# Altium project KEY.PrjPcb
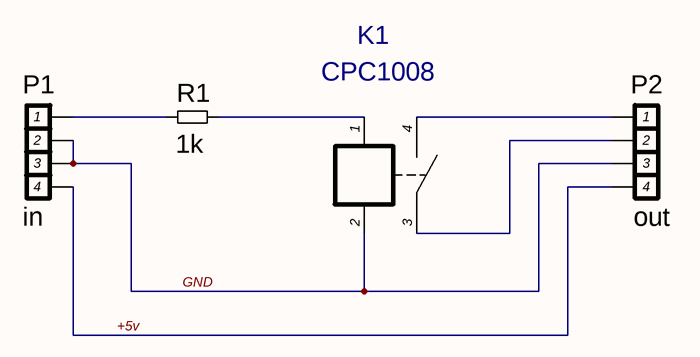
[diagram p0: KEY.SchDoc]
1 sheet, 4 parts. Net scope: global (net labels, ports and power ports of the same name join across sheets).
Board file: KEY.PcbDoc

## Sheet KEY.SchDoc
size A2; Organization: HOME; Address1: L3, 12a Rodborough Rd; Address2: Frenchs Forest; Address3: NSW; Address4: Australia 2086; PageSetup: Record=PageOptions|CenterHorizontal=True|CenterVertical=True|PrintScale=0.49|XCorrection=1.00|YCorrection=1.00|PrintKind=0|BorderSize=5000000|LeftOffset=0|BottomOffset=0|Orientation=2|PaperLength=1000|PaperWidth=1000|Scale=100|PaperSource=7|PrintQuality=-3|MediaType=1|DitherType=10|PrintScaleMode=1|PaperKind=A4|PaperIndex=9

### Parts
K1  CPC1008  [SOIC4]
P1  in  [Header 4]
P2  out  [Header 4]
R1  1k  [RES_0805]

### Nets
+5v: P1.4 P2.4
GND: K1.2 P1.2 P1.3 P2.3
NetK1_1: K1.1 R1.2
NetK1_3: K1.3 P2.2
NetK1_4: K1.4 P2.1
NetP1_1: P1.1 R1.1

### Notes on the sheet
- Title
- Size:
- Date:
- File:
- A2
- Number:
- Time:
- Revision:
- Sheet
- of

### Library data of the parts
K1 = CPC1008: SSRelay
P1 P2 = Header 4
R1 = Resistor: Value: 910